# EAGLE design HDC1010 Acorn (EAGLE 9.5.2)
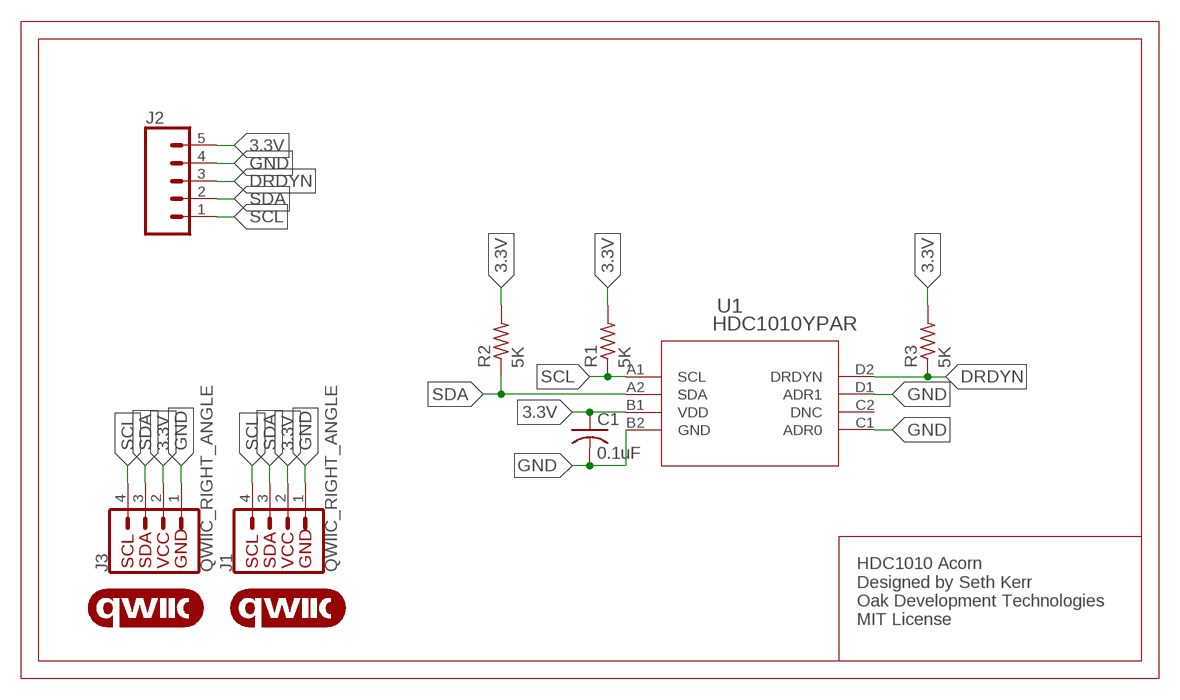
[diagram p0: schematic, sheet 1]

## Parts
C1  0.1uF  C-USC0402  [C0402]
J1  QWIIC_RIGHT_ANGLE  QWIIC_CONNECTORJS-1MM  [JST04_1MM_RA]
J2  CONN_05NO_SILK  [1X05_NO_SILK]
J3  QWIIC_RIGHT_ANGLE  QWIIC_CONNECTORJS-1MM  [JST04_1MM_RA]
LOGO1  QWIIC_LOGO_3MM  [QWIIC_3MM]
LOGO2  QWIIC_LOGO_3MM  [QWIIC_3MM]
R1  5K  R-US_R0603  [R0603]
R2  5K  R-US_R0603  [R0603]
R3  5K  R-US_R0603  [R0603]
U1  HDC1010YPAR  [YPA8_TEX]

## Nets
3.3V: C1.1 J1.2 J2.5 J3.2 R1.2 R2.2 R3.2 U1.B1(VDD)
DRDYN: J2.3 R3.1 U1.D2(DRDYN)
GND: C1.2 J1.1 J2.4 J3.1 U1.B2(GND) U1.C1(ADR0) U1.D1(ADR1)
SCL: J1.4 J2.1 J3.4 R1.1 U1.A1(SCL)
SDA: J1.3 J2.2 J3.3 R2.1 U1.A2(SDA)
Unconnected: U1.C2(DNC)

## Notes on the sheet
- HDC1010 Acorn
  Designed by Seth Kerr
  Oak Development Technologies
  MIT License

## Library data of the parts
C1 = rcl:C-US: CAPACITOR, American symbol; SPICEPREFIX: C
J1 J3 = SparkFun-Connectors:QWIIC_CONNECTOR: SparkFun I2C Standard Qwiic Connector An SMD 1mm pitch JST connector makes it easy and quick (get it? Qwiic?) to connect I2C devices to each other. The Qwiic system <http://www.sparkfun.com/qwiic> enables fast and solderless connection between popular platforms and various sensors and actuators. We carry 200mm <https://www.sparkfun.com/products/14204>, 100mm <https://www.sparkfun.com/products/14205>, 50mm <https://www.sparkfun.com/products/14206>, and breadboard friendly <https://www.sparkfun.com/products/14207> Qwiic cables. We also offer 10 pcs strips <https://www.sparkfun.com/products/14323> the SMD connectors.; PROD_ID: CONN-13694
J2 = SparkFun-Connectors:CONN_05: Multi connection point. Often used as Generic Header-pin footprint for 0.1 inch spaced/style header connections On any of the 0.1 inch spaced packages, you can populate with these: Break Away Headers - Straight <https://www.sparkfun.com/products/116> (PRT-00116) Break Away Male Headers - Right Angle <https://www.sparkfun.com/products/553> (PRT-00553) Female Headers <https://www.sparkfun.com/products/115> (PRT-00115) Break Away Headers - Machine Pin <https://www.sparkfun.com/products/117> (PRT-00117) Break Away Female Headers - Swiss Machine Pin <https://www.sparkfun.com/products/743> (PRT-00743) For SCREWTERMINALS and SPRING TERMINALS visit here: Screw Terimnals on SparkFun.com <https://www.sparkfun.com/search/results?term=Screw+Terminals> (5mm/3.5mm/2.54mm spacing) This device is also useful as a general connection point to wire up your design to another part of your project. Our various solder wires solder well into these plated through hole pads. Hook-Up Wire - Assortment (Stranded, 22 AWG) <https://www.sparkfun.com/products/11375> (PRT-11375) Hook-Up Wire - Assortment (Solid Core, 22 AWG) <https://www.sparkfun.com/products/11367> (PRT-11367) View the entire wire category on our website here <https://www.sparkfun.com/categories/141> Special notes: Molex polarized connector foot print use with SKU : PRT-08231 with associated crimp pins and housings. 1MM SMD Version SKU: PRT-10208
LOGO1 LOGO2 = SparkFun-Aesthetics:QWIIC_LOGO: Qwiic Logos for placement on schematic and PCB. The 5.5mm silk logo is best for placing next to Qwiic connector.
R1-R3 = rcl:R-US_: RESISTOR, American symbol; SPICEPREFIX: R
U1 = HDC1010YPAR:HDC1010YPAR; COPYRIGHT: Copyright (C) 2018 Accelerated Designs. All rights reserved; MANUFACTURER_PART_NUMBER: HDC1010YPAR; SOURCELIBRARY: TI_2019-05-21; VENDOR: Texas Instruments

## Board
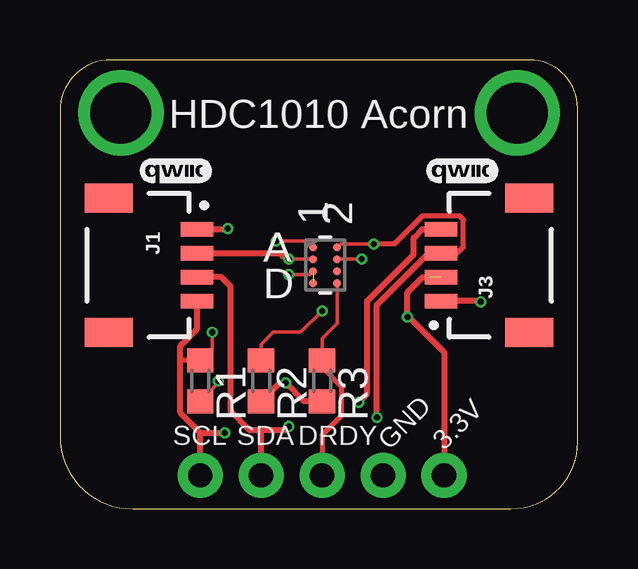
[diagram p1: board, top side]
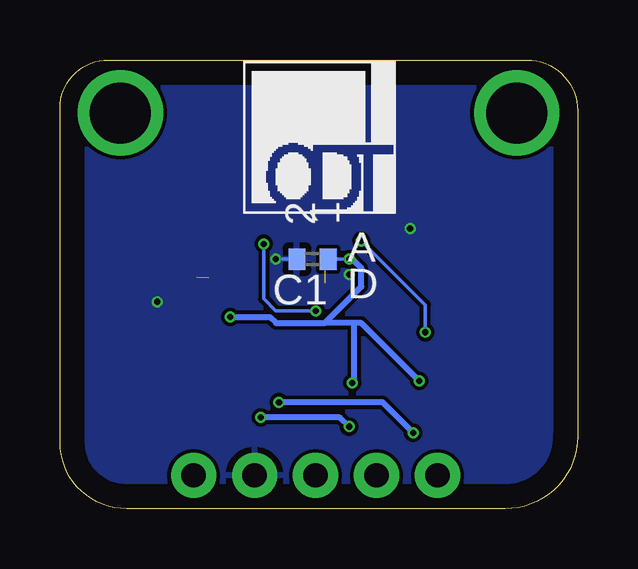
[diagram p2: board, bottom side, seen from below]

Size 21.57 x 18.72 mm. Coordinates in mm from the lower left corner, seen from the top.
Outline: 0,16.61 0,3.02 arc90 3.02,0 18.79,0 arc90 21.57,2.78 21.57,16.72 arc90 19.57,18.72 2.11,18.72 arc90 0,16.61
Copper layers (1*16): Top 0.035mm / dielectric 1.5mm / Bottom 0.035mm
Design rules "default *": minimum track width 6mil, minimum drill 10mil, track to track 6mil, track to pad 6mil, pad to pad 6mil, via to via 6mil, smd to smd 6mil, copper to edge 40mil, drill to drill 6mil, minimum pad ring 10mil, minimum via ring 4mil, stop-mask expansion 4mil, vias tented up to drill 20mil, thermal gap 10mil

### Footprints (pad centres in the part's own frame; a part is rotated, then mirrored left to right if it is on the bottom)
C0402 = smd 0.7 x 0.9: 1 -0.65,0; 2 0.65,0
JST04_1MM_RA = smd 0.6 x 1.35: 1 -1.5,0; 2 -0.5,0; 3 0.5,0; 4 1.5,0 | smd 1.2 x 2: NC1 2.8,-3.675; NC2 -2.8,-3.675
1X05_NO_SILK = drill 1.016 pad 1.88: 1 0,0; 2 2.54,0; 3 5.08,0; 4 7.62,0; 5 10.16,0
R0603 = smd 1 x 1.1: 1 -0.85,0; 2 0.85,0
YPA8_TEX = smd 0.335 x 0.335: A1 -0.5,0.75; A2 0.5,0.75; B1 -0.5,0.25; B2 0.5,0.25; C1 -0.5,-0.25; C2 0.5,-0.25; D1 -0.5,-0.75; D2 0.5,-0.75

### Placement (x,y rotation side)
C1  11.05,10.41 180 bottom
J1  5.71,10.16 270 top
J2  5.84,1.4 0 top
J3  15.88,10.16 90 top
LOGO1  4.83,14.1 0 top
LOGO2  16.76,14.1 0 top
R1  5.84,5.33 270 top
R2  8.38,5.33 270 top
R3  10.92,5.33 270 top
U1  11.05,10.16 0 top

### Tracks (layer width: path | path; a pad name or v marks a point on that pad's centre or on a via)
3.3V  (via drill 0.25)  (1 unrouted)
  Top 0.152: 9.27,10.54 9.4,10.41 v9.53,10.41 U1.B1 | R1.2 6.6,5.25 v6.6,5.33
  Top 0.254: J2.5 16,6.53 14.53,8 v14.48,8 14.48,9.02 15.12,9.66 J3.2 | 15.37,9.65 15.38,9.66 | J1.2 9.15,10.66 9.27,10.54 | R2.2 9.15,5.25 v9.4,5.25 10.16,4.48 R3.2
  Bottom 0.152: C1.1 v9.53,10.41
  Bottom 0.254: v14.48,8 12.82,8 12.57,7.75 10.54,7.75 | v9.53,10.41 9.39,10.41 9.02,10.03 9.02,9.27 10.54,7.75 | v6.6,5.33 9.02,7.75 9.31,7.75 | 9.31,7.75 10.54,7.75 | v9.4,5.25 9.31,5.33 9.31,7.75
DRDYN
  Top 0.152: U1.D2 11.55,7.74 10.92,7.11 R3.1
  Top 0.203: R3.1 10.92,5.89 11.73,5.09 11.73,3.88 10.92,3.08 J2.3
GND  (via drill 0.25)  (1 unrouted)
  Top 0.152: U1.C1 10.42,9.78 v9.53,9.78 | U1.B2 v12.57,10.41
  Top 0.254: J1.1 6.96,11.66 v6.99,11.68 | v17.53,8.64 17.5,8.66 J3.1
  Bottom 0.152: C1.2 v12.57,10.41
  pour Bottom: -1.27,20.32 22.86,20.32 22.86,-1.27 -1.27,-1.27
N$3  (via drill 2.54)
  other vias: 2.54,16.51
N$4  (via drill 2.54)
  other vias: 19.05,16.51
SCL  (via drill 0.25)
  Top 0.152: R1.1 6.35,6.69 v6.35,7.37 | v9.02,11.18 10.28,11.18 U1.A1
  Top 0.203: R1.1 5.02,6.18 5.01,6.18
  Top 0.254: J2.1 5.84,3.17 | J1.4 5.71,7.5 5.01,6.8 5.01,6.18 5.01,4 5.84,3.17 | 5.84,3.17 v6.86,3.17 | v12.45,4.45 12.8,4.8 12.8,8.68 14.73,10.61 14.73,11.3 15.09,11.66 J3.4
  Bottom 0.152: v6.35,7.37 6.35,8.51 v9.02,11.18
  Bottom 0.254: v6.86,3.17 8.13,4.45 v12.45,4.45
SDA  (via drill 0.25)
  Top 0.152: U1.A2 11.69,11.05 v13.08,11.05 | v10.92,8.26 10.03,7.37 8.89,7.37 8.38,6.86 R2.1
  Top 0.203: v13.08,11.05 13.93,11.05 15.1,12.21 16.66,12.21 16.8,12.06 16.8,10.91 16.55,10.66 J3.3
  Top 0.254: J2.2 8.38,3.3 | 8.38,3.3 7.87,3.3 7.11,4.06 7.11,9.27 6.72,9.66 J1.3 | 8.38,3.3 9.4,3.3 v9.53,3.43 | v13.21,3.81 13.21,8.51 15.36,10.66 J3.3
  Bottom 0.152: v13.08,11.05 13.08,8.76 12.57,8.26 v10.92,8.26
  Bottom 0.254: v9.53,3.43 9.91,3.81 v13.21,3.81

### Text on the board
tNames: HDC1010 Acorn | SCL | SDA | DRDY | GND | 3.3V
tStop: /Users/sethkerr/Downloads/OakDevTech-reverse.bmp